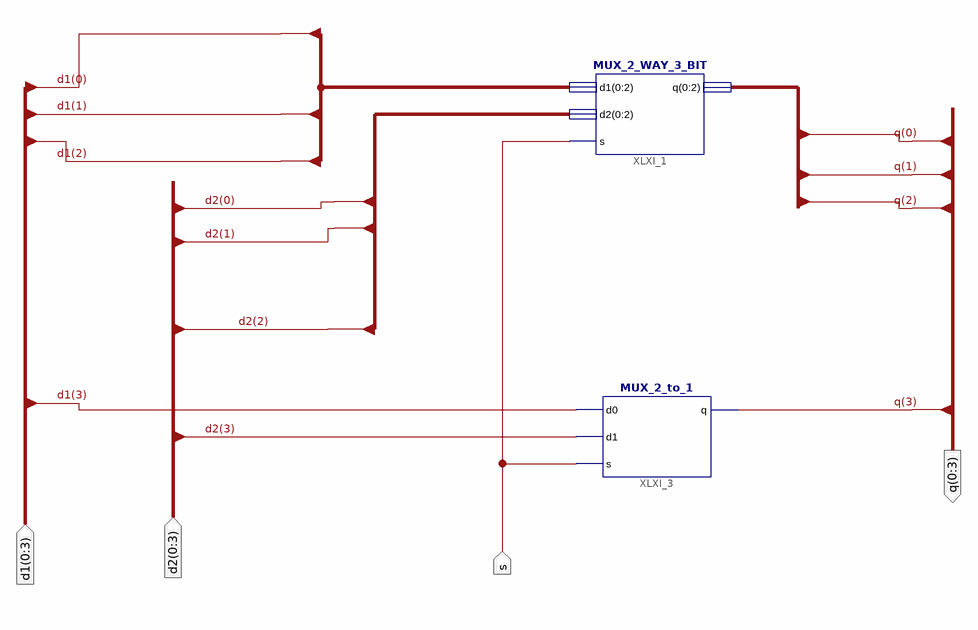
[diagram p0: schematic sheet 1]
// Xilinx ISE schematic MUX_2_W_4_B.sch (spartan3e) as structural Verilog: 2 symbols, 4 ports
module MUX_2_W_4_B (
  input  [0:3] d1,
  input  [0:3] d2,
  input  s,
  output [0:3] q
);

  MUX_2_WAY_3_BIT XLXI_1 (.d1(d1[0:2]), .d2(d2[0:2]), .q(q[0:2]), .s(s));
  MUX_2_to_1 XLXI_3 (.d0(d1[3]), .d1(d2[3]), .s(s), .q(q[3]));
endmodule
